# Altium schematic sheet AOut_Isolator.SchDoc
size A4; DocumentNumber: 3; SheetNumber: 3; SheetTotal: 16
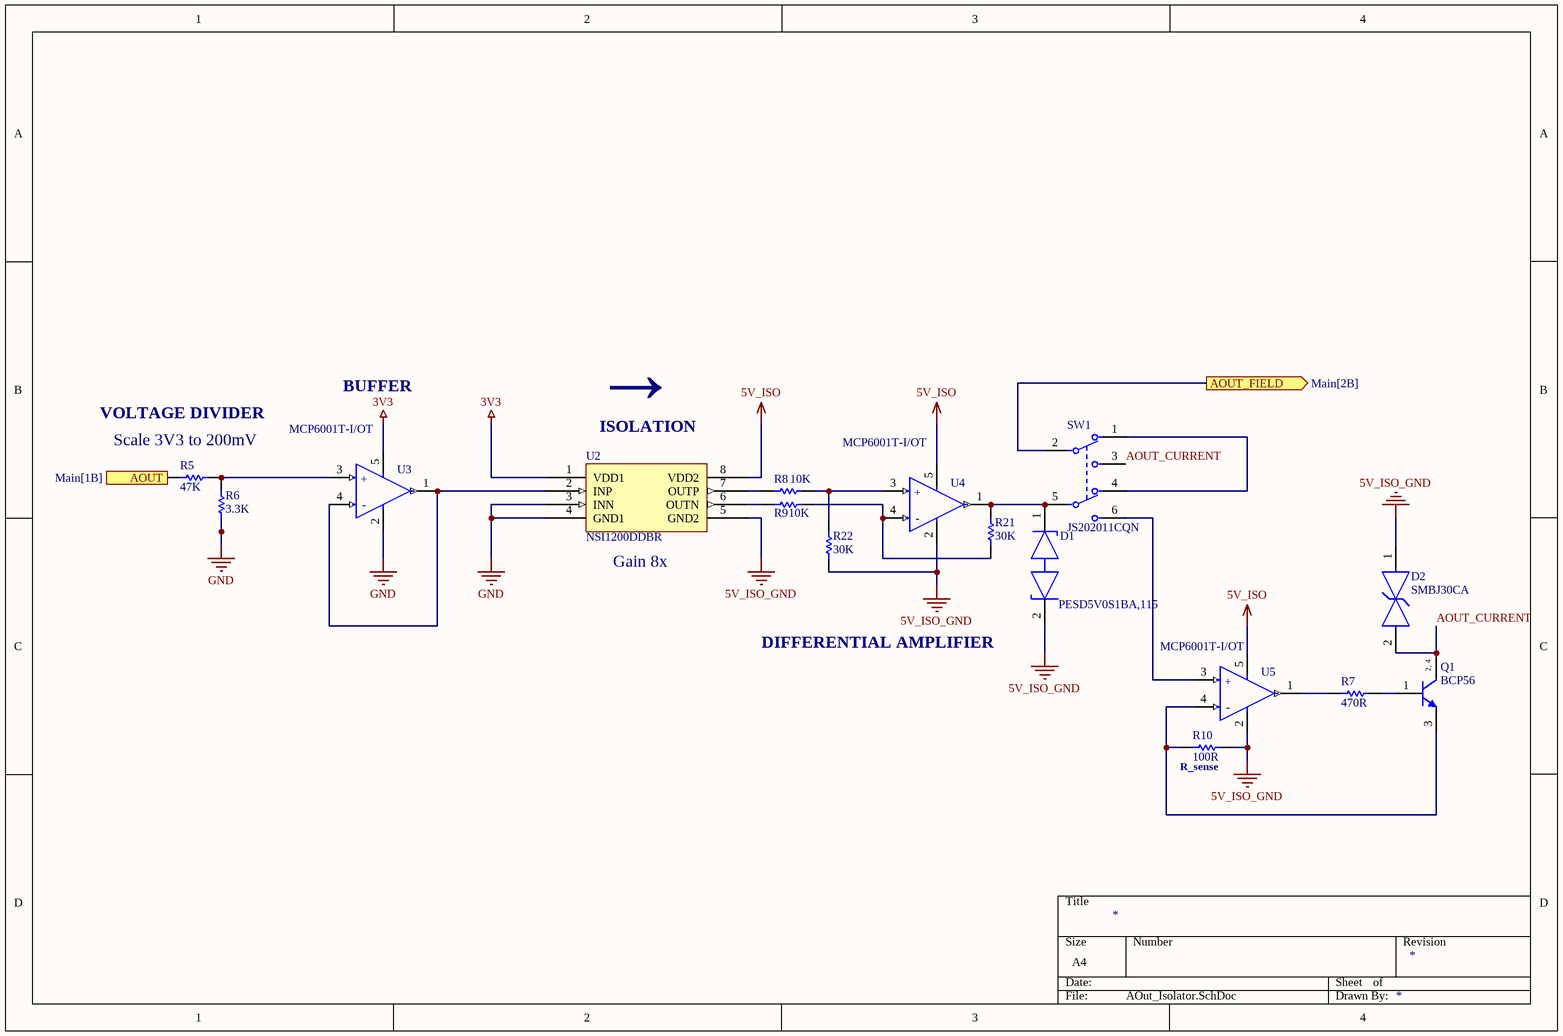
[diagram p0: AOut_Isolator.SchDoc]

## Parts
D1  PESD5V0S1BA,115  [FP-SOD323-CA-MFG]
D2  SMBJ30CA  [FP-SMBJ30CAHE3-52-MFG]
Q1  BCP56  [ONSC-SOT-223-4-318E-04_V]
R5  47K  [RESC1608X55X30NL15T15]
R6  3.3K  [RESC1609X55X30ML15T15]
R7  470R  [RESC1608X55X30NL15T15]
R8  10K  [RESC1609X55X30LL15T15]
R9  10K  [RESC1609X55X30LL15T15]
R10  100R  [RESC3216X70X50NL05T20]
R21  30K  [RESC1608X55X30LL15T15]
R22  30K  [RESC1608X55X30LL15T15]
SW1  JS202011CQN  [FP-JS202011CQN-MFG - duplicate]
U2  NSI1200DDBR  [NSI1200DDBR]
U3  MCP6001T-I/OT  [FP-C04-091-OT-IPC_A]
U4  MCP6001T-I/OT  [FP-C04-091-OT-IPC_A]
U5  MCP6001T-I/OT  [FP-C04-091-OT-IPC_A]

## Ports
AOUT (in, see Main[1B]), AOUT_FIELD (out, see Main[2B])

## Nets
3V3: U2.1(VDD1) U3.5(VDD)
5V_ISO: U2.8(VDD2) U4.5(VDD) U5.5(VDD)
5V_ISO_GND: D1.2(K2) D2.1 R10.1 R22.2 U2.5(GND2) U4.2(VSS) U5.2(VSS)
GND: R6.2 U2.3(INN) U2.4(GND1) U3.2(VSS)
AOUT: R5.1 ; port AOUT
AOUT_CURRENT: D2.2 Q1.2(C) Q1.4(C) SW1.3
AOUT_FIELD: SW1.2 ; port AOUT_FIELD
NetD1_1: D1.1(K1) R21.1 SW1.5 U4.1(VOUT)
NetQ1_1: Q1.1(B) R7.2
NetQ1_3: Q1.3(E) R10.2 U5.4(VIN-)
NetR5_2: R5.2 R6.1 U3.3(VIN+)
NetR7_1: R7.1 U5.1(VOUT)
NetR8_1: R8.1 U2.7(OUTP)
NetR8_2: R8.2 R22.1 U4.3(VIN+)
NetR9_1: R9.1 U2.6(OUTN)
NetR9_2: R9.2 R21.2 U4.4(VIN-)
NetSW1_1: SW1.1 SW1.4
NetSW1_6: SW1.6 U5.3(VIN+)
NetU2_2: U2.2(INP) U3.1(VOUT) U3.4(VIN-)

## Notes on the sheet
- (near U2) ←
- VOLTAGE DIVIDER
- Scale 3V3 to 200mV
- BUFFER
- (near U2) ISOLATION
- (near U2) Gain 8x
- DIFFERENTIAL AMPLIFIER
- (near R10) R_sense
- (in symbol CMP-0187-00462-3) +; -
- (in symbol CMP-1048-00522-1) 2, 4

## Library data of the parts
D1 = CMP-14432-000001-1: TVS DIODE 5V 14V SOD323
D2 = CMP-02577-000018-1: TVS DIODE 30V 48.4V DO214AA; Manufacturer: Vishay Semiconductor Diodes Division; Manufacturer Part Number: SMBJ30CAHE3/52; Peak Pulse Power: 600W; Number Of Channels: 1; Automotive Grade: Grade 0; Peak Pulse Current: 12.4A; Standoff Height: 0mm; Max Junction Temp: +150°C; Breakdown Voltage: 33.3V; Direction: Bidirectional; Octopart: https://octopart.com/smbj30cahe3%2F52-vishay-43725255; Footprint Url: http://www.vishay.com/docs/95401/smb.pdf; Device Class L2: TVS Diodes; RoHS: TRUE; Automotive: Yes; Height: 2.44mm; Temperature: -55°C to +150°C; Category: Diode; ComponentLink2Description: Datasheet; Reverse Standoff Voltage: 30V; Device Class L3: unset; Package: DO-214AA; ComponentLink2URL: http://www.vishay.com/docs/88392/smbj.pdf; Temperature Range Low: -55°C; Mouser Description: Diode TVS Single Bi-Dir 30V 600W 2-Pin DO-214AA T/R; Temperature Range High: +150°C; Digikey Description: TVS DIODE 30V 48.4V DO214AA; Clamping Voltage: 48.4V; Lead Free: Yes; Device Class L1: Circuit Protection
Q1 = CMP-1048-00522-1: NPN Silicon Epitaxial Transistor, 4-Pin SOT-223, Pb-Free, Tape and Reel; PartNumber: SBCP56T1G; Manufacturer: On Semiconductor; IC Continuous (A): 1; ComponentLink1URL: http://www.onsemi.com/; DatasheetVersion: Rev. 8; Polarity: NPN; ComponentLink1Description: Manufacturer URL; PackageDescription: 4-Pin Small Outline Transistor, Body 6.5 x 3.5 mm, Pitch 2.3 mm; RoHS: TRUE; Packing: Tape and Reel; Mounting Technology: Surface Mount; PackageReference: SOT-223-4-318E-04; PackageVersion: Rev. N, 08/2009; ComponentLink2URL: http://www.onsemi.com/pub_link/Collateral/BCP56T1-D.PDF; ComponentLink3Description: Package Specification; ComponentLink2Description: Datasheet; ComponentLink3URL: http://www.onsemi.com/pub_link/Collateral/318E-04.PDF
R5 = CMP-2000-00523-2: Chip Resistor, 47 KOhm, +/- 1%, 0.1 W, -55 to 155 degC, 0603 (1608 Metric), RoHS, Tape and Reel; Case\Package: 0603; Forward Current: 20 mA; Power Rating: 90 mW; Illumination Colour: Red; Nominal Vf: 2.1 V; Viewing Angle: 160 degrees; Luminous Intensity: 63 mcd; Lens Style: Clear; Nominal Wavelength: 639 nm; Case Code (Imperial): 0603; Case Code (Metric): 1608; Packaging: Tape and Reel; Radiation Hardening: No; Colour: Red; PackageDescription: 2-Pin Surface Mount Device, Body 1.6 x 0.85 mm; ComponentLink1Description: Manufacturer URL; Width: 0.8 mm; DatasheetVersion: Apr-15; ComponentLink2URL: http://industrial.panasonic.com/cdbs/www-data/pdf/RDA0000/AOA0000C86.pdf; Min Operating Temperature: -40 degC; Height: 0.6 mm; Package Quantity: 3000; ComponentLink2Description: Datasheet; REACH SVHC: No SVHC; ComponentLink1URL: http://www.panasonic.com/; Mount: Surface Mount; RoHSCompliant: true; Max Operating Temperature: 100 degC; PackageReference: 0603; Length: 1.6 mm; Forward Voltage: 2.1 V; Pins: 2
R6 = CMP-2000-00436-2: Chip Resistors, 3.3 KOhm, +/- 1%, 0.1 W, 0603 (1608 Metric), -55 to 155 degC, RoHS, Tape and Reel; Manufacturer: Panasonic; Max Power Dissipation: 100mW; Voltage Rating: 75V; Temperature Coefficient: 100ppm/degreesC; Datasheet Version: 42095.0; Width: 0.8mm; Mount: SurfaceMount; Radiation Hardening: No; Package URL: http://www.st.com/st-web-ui/static/active/en/resource/technical/document/datasheet/CD00001320.pdf; Depth: 0.8mm; Package Description: 2-Pin Surface Mount Device, Body 1.6 x 0.85 mm; Package Quantity: 1; Contact Plating: Tin; Length: 1.6mm; Max Operating Temperature: 155degC; RoHSCompliant: true; Datasheet URL: https://industrial.panasonic.com/cdbs/www-data/pdf/RDA0000/AOA0000C283.pdf; Height: 0.022inch; Military Standard: Not; Termination: SMD/SMT; Case Code (Metric): 1608; Composition: ThickFilm; Resistance: 3.3KOhm; Packaging: TapeandReel; Min Operating Temperature: -55degC; Case/Package: 0603; Voltage Rating (DC): 75V; Lead Free: LeadFree; Package Reference: 0603; Power Rating: 100mW; Manufacturer URL: http://www.panasonic.com/; Case Code (Imperial): 0603; REACH SVHC: NoSVHC; Number of Terminations: 2; Number of Pins: 2; Tolerance: 1%
R7 = CMP-1012-00586-3: Precision Thick Film Chip Resistor, 4.7 KOhm, +/- 1%, -55 to 155 degC, 0603 (1608 Metric), RoHS, Tape and Reel; Resistance: 220 Ohm; Voltage Rating: 50 V; Elements: 4; Case\Package: 1205; Tolerance: 5%; Power Rating: 250 mW; PackageReference: 0603; Max Operating Temperature: 125 degC; REACH SVHC: No SVHC; Width: 0.063 inch; Length: 0.126 inch; Height: 0.024 inch; Mount: Surface Mount; Package Quantity: 1; DatasheetVersion: Apr-15; ComponentLink1Description: Manufacturer URL; Min Operating Temperature: -55 degC; Packaging: Tape and Reel; Radiation Hardening: No; ComponentLink2URL: http://industrial.panasonic.com/cdbs/www-data/pdf/RDA0000/AOA0000C86.pdf; Case Code (Metric): 3216; Pins: 8; Case Code (Imperial): 1206; Type (Resistor): Thick Film; RoHSCompliant: true; ComponentLink2Description: Datasheet; PackageDescription: 2-Pin Surface Mount Device, Body 1.6 x 0.85 mm; ComponentLink1URL: http://www.panasonic.com/
R8 R9 = CMP-1012-00623-3: Chip Resistor, 10 KOhm, +/- 1%, 0.1 W, -55 to 155 degC, 0603 (1608 Metric), RoHS, Tape and Reel; Manufacturer: Panasonic; Voltage Rating: 75V; Case\/Package: 0603; Power Rating: 100mW; Resistance: 10KOhm; Temperature Coefficient: 100ppm\/degreesC; Number of Pins: 2; Package Reference: 603; Depth: 0.8mm; Mount: SurfaceMount; Package Description: 2-Pin Surface Mount Device, Body 1.6 x 0.85 mm; Datasheet Version: 02/2017; Length: 1.6mm; Lead Free: LeadFree; Height: 0.45mm; Number of Terminations: 2; Max Power Dissipation: 100mW; Min Operating Temperature: -55degC; Datasheet URL: https://industrial.panasonic.com/cdbs/www-data/pdf/RDA0000/AOA0000C304.pdf; Termination: SMD/SMT; Case Code (Metric): 1608; Case Code (Imperial): 0603; Tolerance: 1%; Max Operating Temperature: 155degC; RoHSCompliant: true; Voltage Rating (DC): 75V; Radiation Hardening: No; Packaging: TapeandReel; Composition: ThickFilm; Mounting Technology: SurfaceMount; Manufacturer URL: http://www.panasonic.com/; Width: 0.031inch; REACH SVHC: NoSVHC; Contact Plating: Tin; Military Standard: Not; Package Quantity: 1
R10 = CMP-2003-00592-1: Part Number: ERJ-8GEYJ241V; Manufacturer: Panasonic
R21 R22 = CMP-1012-00109-2: Part Number: ERJ-3GEYJ303V; Manufacturer: Panasonic
SW1 = CMP-10038-000022-1_1: SWITCH SLIDE DPDT 300MA 6V; Contact Resistance: 70mR; Actuator Type: Standard; Actuator Color: Black; Actuator Material: Nylon; Actuator Length: 2mm; Contact Current Rating: 100mA; Electrical Life: 5000Cycles; Illumination Type: Non-Illuminated; Switch Function: On-On; Depth: 3.6mm; Lead Free: Lead Free; Current Rating: 300mA; Throw Configuration: DPDT; REACH SVHC: No SVHC; Flammability Rating: UL94 V-0; Contact Plating: Silver; Max Current Rating: 300mA; Packaging: Bulk; Radiation Hardening: No; Switch Travel: 2mm; Package Quantity: 1; Voltage Rating (DC): 6V; Housing Material: Nylon; Contact Material: Copper Alloy; Min Operating Temperature: -40°C; Max Operating Temperature: 85°C; Termination: PC Pins; Mount: Through Hole; Length: 9mm; Max Voltage Rating (DC): 6V; RoHS Compliant: Yes; Series: JS; Orientation: Vertical
U2 = NSI1200DDBR: High Reliability Reinforced Isolated Amplifier; Manufacturer: Novosense; Manufacturer Part Number: NSI1200DDBR; ComponentLink1Description: Datasheet; ComponentLink1URL: https://file.elecfans.com/web2/M00/63/D8/poYBAGMEo2GAVfdLABzacvfTaPY750.pdf
U3-U5 = CMP-0187-00462-3: IC OPAMP GP 1 CIRCUIT SOT23-5; Number of Amplifiers: 1; Voltage: 6V; Power Supply Rejection Ratio (PSRR): 86dB; Common Mode Rejection Ratio: 60dB; Unity Gain Bandwidth Product: 1MHz; Slew Rate: 0.6V/µs; Output Current per Channel: 23mA; Nominal Supply Current: 100uA; Input Offset Voltage (Vos): 4.5mV; Input Bias Current: 1pA; Operating Supply Voltage: 5.5V; Min Supply Voltage: 1.8V; Voltage Gain: 112dB; Length: 3.1mm; REACH SVHC: No SVHC; Number of Pins: 5; Package Quantity: 1; Radiation Hardening: No; Mount: Surface Mount; Number of Circuits: 1; Number of Elements: 1; Output Current: 23mA; Packaging: Tape and Reel; Height: 1.3mm; Lead Free: Lead Free; Min Operating Temperature: -40°C; Bandwidth: 1MHz; Contact Plating: Tin; Max Supply Voltage: 6V; Max Operating Temperature: 85°C; Width: 1.8mm; Case/Package: SOT-23; Operating Supply Current: 100uA; Number of Channels: 1; Gain Bandwidth Product: 1MHz